# Altium schematic sheet Main.SchDoc: Main
size A4; DocumentNumber: 1; SheetNumber: 1; SheetTotal: 5
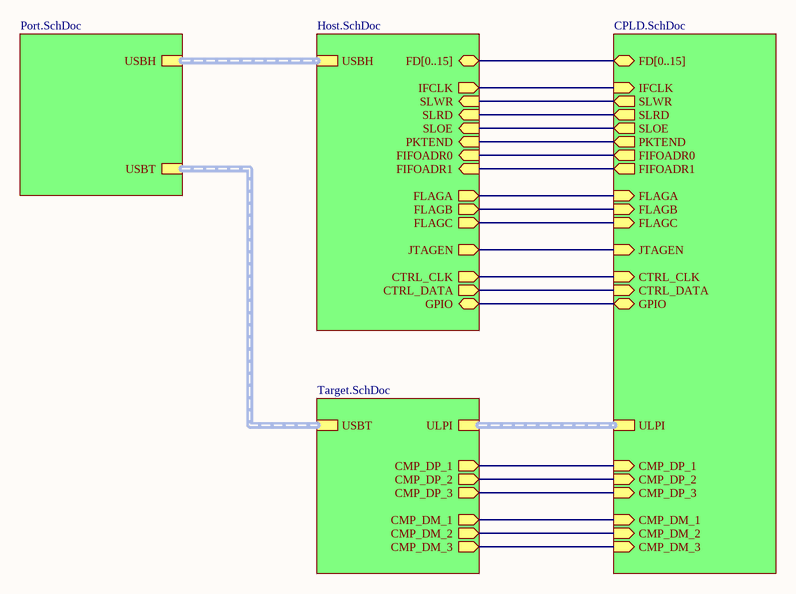
[diagram p0: Main.SchDoc]

## Sub-sheets
U_CPLD = CPLD.SchDoc: CTRL_CLK (in), JTAGEN (in), SLOE (out), FIFOADR0 (out), FIFOADR1 (out), PKTEND (out), GPIO (bidir), FD[0..15] (bidir), SLRD (out), SLWR (out), FLAGA (in), FLAGB (in), FLAGC (in), IFCLK (in), ULPI (harness ULPI), CMP_DM_1 (in), CMP_DP_1 (in), CMP_DP_2 (in), CMP_DM_2 (in), CMP_DP_3 (in), CMP_DM_3 (in), CTRL_DATA (in)
U_Host = Host.SchDoc: USBH (harness USB), CTRL_CLK (out), JTAGEN (out), SLOE (in), CTRL_DATA (out), FIFOADR0 (in), FIFOADR1 (in), PKTEND (in), GPIO (bidir), FD[0..15] (bidir), SLRD (in), SLWR (in), FLAGA (out), FLAGB (out), FLAGC (out), IFCLK (out)
U_Port = Port.SchDoc: USBH (harness USB), USBT (harness USB)
U_Target = Target.SchDoc: USBT (harness USB), ULPI (harness ULPI), CMP_DM_1 (out), CMP_DP_1 (out), CMP_DP_2 (out), CMP_DM_2 (out), CMP_DP_3 (out), CMP_DM_3 (out)

## Nets
(unnamed): sheet U_Host/CTRL_CLK, sheet U_CPLD/CTRL_CLK
(unnamed): sheet U_Host/JTAGEN, sheet U_CPLD/JTAGEN
(unnamed): sheet U_Host/SLOE, sheet U_CPLD/SLOE
(unnamed): sheet U_Host/CTRL_DATA, sheet U_CPLD/CTRL_DATA
(unnamed): sheet U_Host/FIFOADR0, sheet U_CPLD/FIFOADR0
(unnamed): sheet U_Host/FIFOADR1, sheet U_CPLD/FIFOADR1
(unnamed): sheet U_Host/PKTEND, sheet U_CPLD/PKTEND
(unnamed): sheet U_Host/GPIO, sheet U_CPLD/GPIO
(unnamed): sheet U_Host/SLRD, sheet U_CPLD/SLRD
(unnamed): sheet U_Host/SLWR, sheet U_CPLD/SLWR
(unnamed): sheet U_Host/FLAGA, sheet U_CPLD/FLAGA
(unnamed): sheet U_Host/FLAGB, sheet U_CPLD/FLAGB
(unnamed): sheet U_Host/FLAGC, sheet U_CPLD/FLAGC
(unnamed): sheet U_Host/IFCLK, sheet U_CPLD/IFCLK
(unnamed): sheet U_CPLD/CMP_DM_1, sheet U_Target/CMP_DM_1
(unnamed): sheet U_CPLD/CMP_DP_1, sheet U_Target/CMP_DP_1
(unnamed): sheet U_CPLD/CMP_DP_2, sheet U_Target/CMP_DP_2
(unnamed): sheet U_CPLD/CMP_DM_2, sheet U_Target/CMP_DM_2
(unnamed): sheet U_CPLD/CMP_DP_3, sheet U_Target/CMP_DP_3
(unnamed): sheet U_CPLD/CMP_DM_3, sheet U_Target/CMP_DM_3

## Buses and harness runs
bus sheet U_CPLD/FD[0..15] = sheet U_Host/FD[0..15]
harness sheet U_CPLD/ULPI = sheet U_Target/ULPI
harness sheet U_Host/USBH = sheet U_Port/USBH
harness sheet U_Port/USBT = sheet U_Target/USBT

## Notes on the sheet
- Title
- Size:
- Date:
- A4
- Number:
- Time:
- Revision:
- Sheet
- of
- File: